# EAGLE design LED-Cube_v2 (EAGLE 9.6.2)
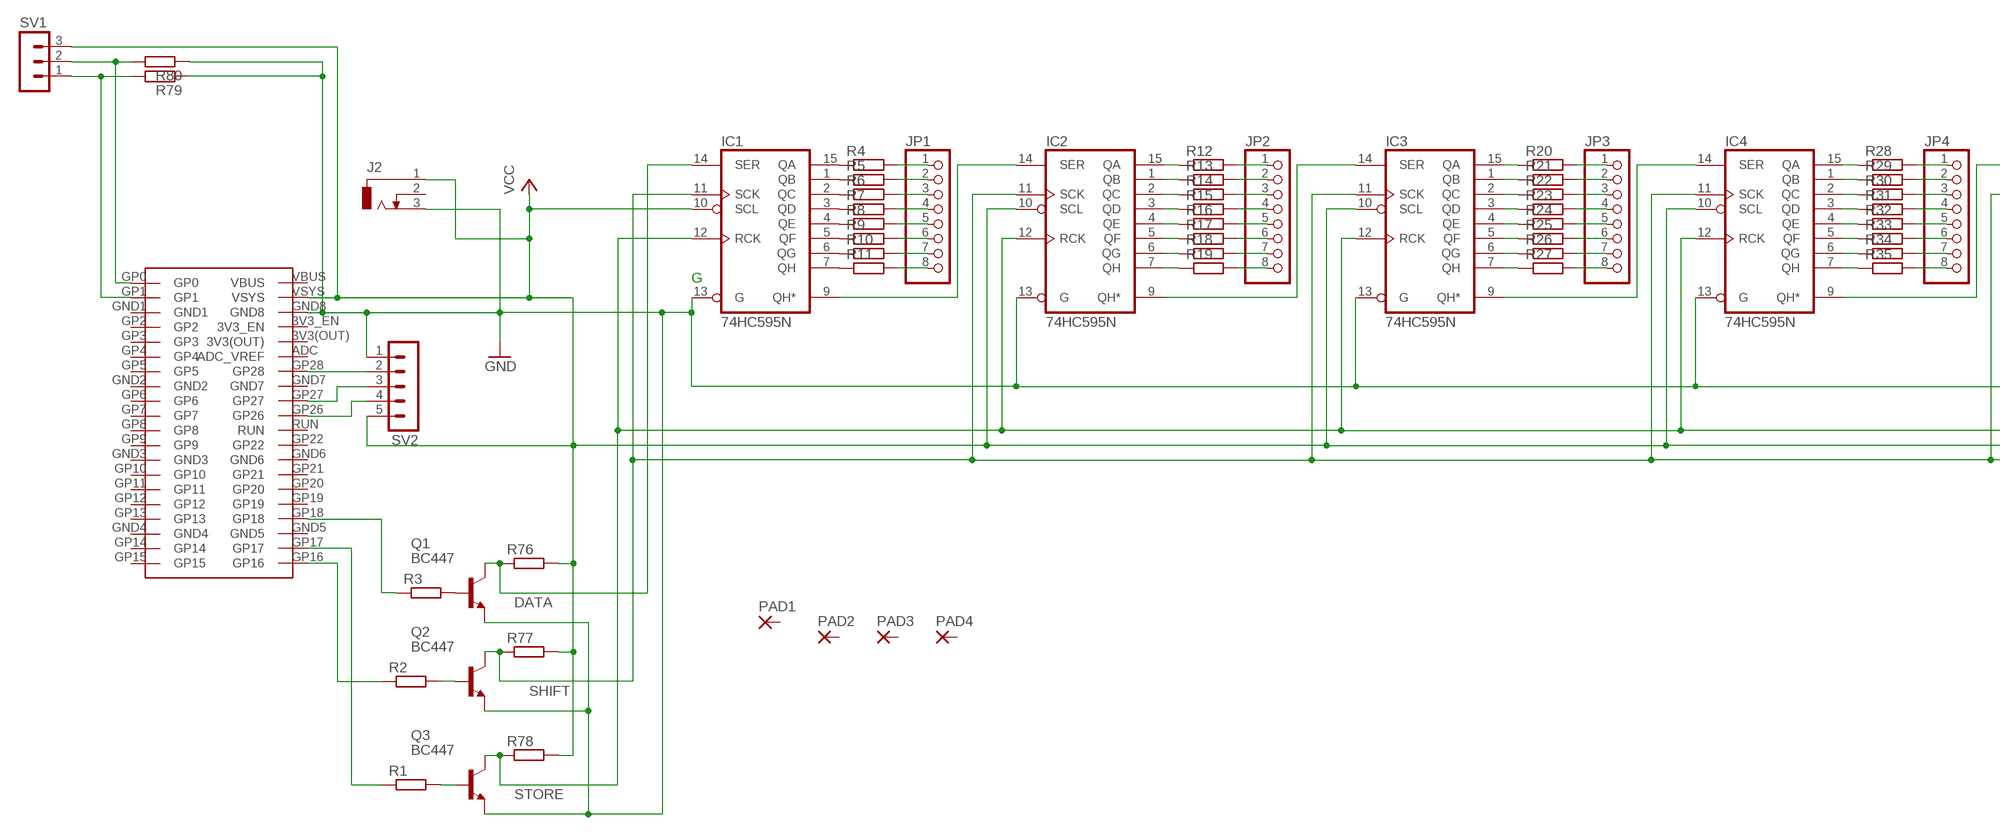
[diagram p0: schematic, sheet 1, part 1 of 2]
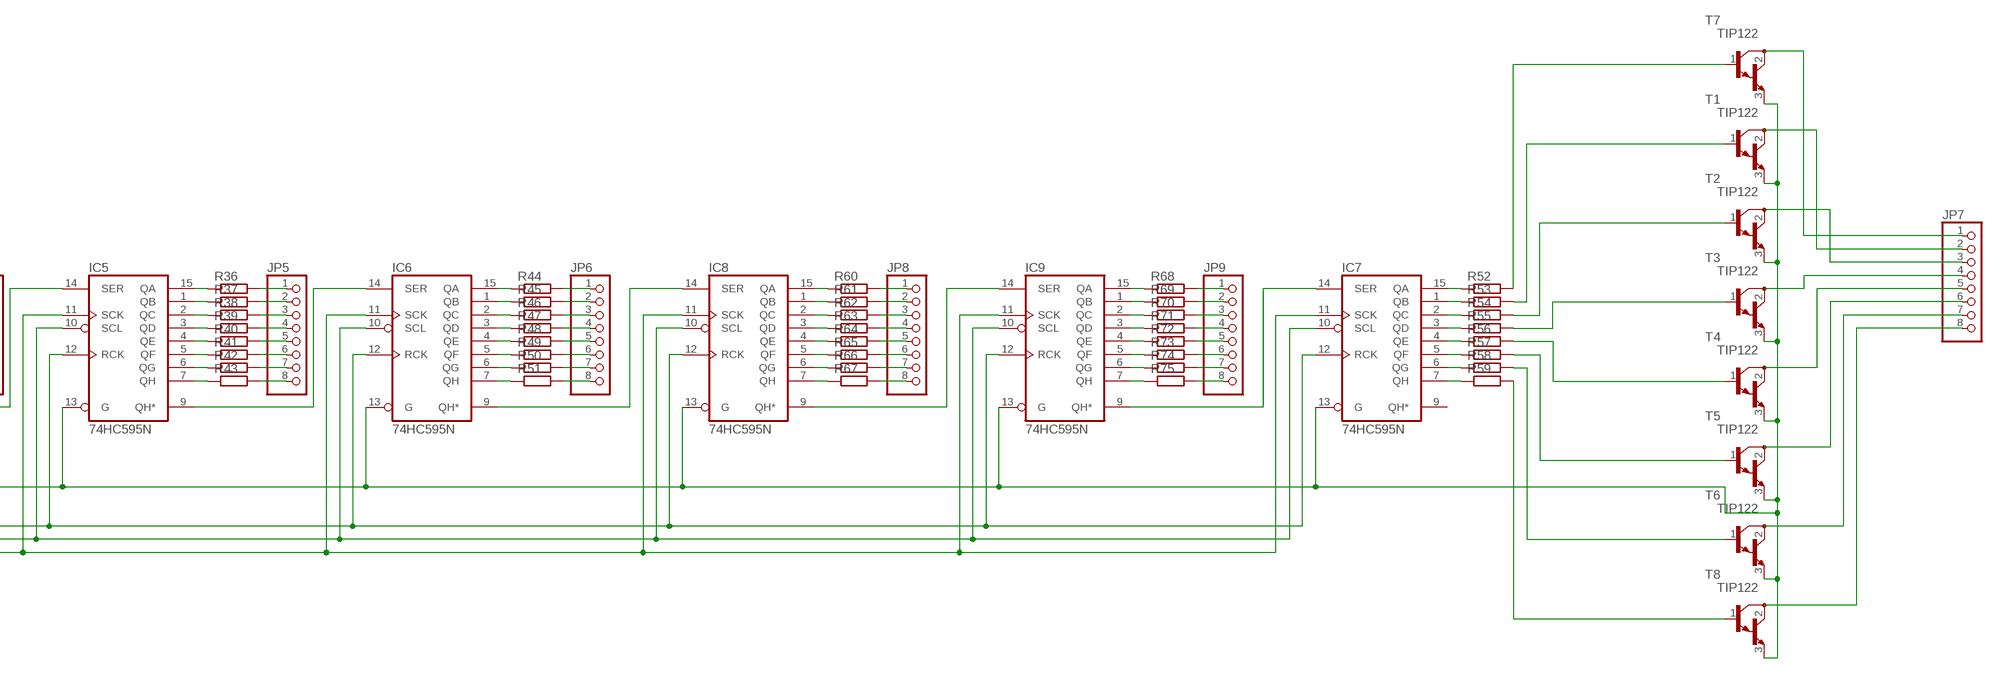
[diagram p1: schematic, sheet 1, part 2 of 2]

## Parts
IC1  74HC595N  [DIL16]
IC2  74HC595N  [DIL16]
IC3  74HC595N  [DIL16]
IC4  74HC595N  [DIL16]
IC5  74HC595N  [DIL16]
IC6  74HC595N  [DIL16]
IC7  74HC595N  [DIL16]
IC8  74HC595N  [DIL16]
IC9  74HC595N  [DIL16]
J2  DCJ0303  [DCJ0303]
JP1  PINHD-1X8  [1X08]
JP2  PINHD-1X8  [1X08]
JP3  PINHD-1X8  [1X08]
JP4  PINHD-1X8  [1X08]
JP5  PINHD-1X8  [1X08]
JP6  PINHD-1X8  [1X08]
JP7  PINHD-1X8  [1X08]
JP8  PINHD-1X8  [1X08]
JP9  PINHD-1X8  [1X08]
PAD1  3,81/1,4  [3,81/1,4]
PAD2  3,81/1,4  [3,81/1,4]
PAD3  3,81/1,4  [3,81/1,4]
PAD4  3,81/1,4  [3,81/1,4]
Q1  BC447  [TO92-EBC]
Q2  BC447  [TO92-EBC]
Q3  BC447  [TO92-EBC]
R1  R-EU_0207/10  [0207/10]
R2  R-EU_0207/10  [0207/10]
R3  R-EU_0207/10  [0207/10]
R4  R-EU_0207/10  [0207/10]
R5  R-EU_0207/10  [0207/10]
R6  R-EU_0207/10  [0207/10]
R7  R-EU_0207/10  [0207/10]
R8  R-EU_0207/10  [0207/10]
R9  R-EU_0207/10  [0207/10]
R10  R-EU_0207/10  [0207/10]
R11  R-EU_0207/10  [0207/10]
R12  R-EU_0207/10  [0207/10]
R13  R-EU_0207/10  [0207/10]
R14  R-EU_0207/10  [0207/10]
R15  R-EU_0207/10  [0207/10]
R16  R-EU_0207/10  [0207/10]
R17  R-EU_0207/10  [0207/10]
R18  R-EU_0207/10  [0207/10]
R19  R-EU_0207/10  [0207/10]
R20  R-EU_0207/10  [0207/10]
R21  R-EU_0207/10  [0207/10]
R22  R-EU_0207/10  [0207/10]
R23  R-EU_0207/10  [0207/10]
R24  R-EU_0207/10  [0207/10]
R25  R-EU_0207/10  [0207/10]
R26  R-EU_0207/10  [0207/10]
R27  R-EU_0207/10  [0207/10]
R28  R-EU_0207/10  [0207/10]
R29  R-EU_0207/10  [0207/10]
R30  R-EU_0207/10  [0207/10]
R31  R-EU_0207/10  [0207/10]
R32  R-EU_0207/10  [0207/10]
R33  R-EU_0207/10  [0207/10]
R34  R-EU_0207/10  [0207/10]
R35  R-EU_0207/10  [0207/10]
R36  R-EU_0207/10  [0207/10]
R37  R-EU_0207/10  [0207/10]
R38  R-EU_0207/10  [0207/10]
R39  R-EU_0207/10  [0207/10]
R40  R-EU_0207/10  [0207/10]
R41  R-EU_0207/10  [0207/10]
R42  R-EU_0207/10  [0207/10]
R43  R-EU_0207/10  [0207/10]
R44  R-EU_0207/10  [0207/10]
R45  R-EU_0207/10  [0207/10]
R46  R-EU_0207/10  [0207/10]
R47  R-EU_0207/10  [0207/10]
R48  R-EU_0207/10  [0207/10]
R49  R-EU_0207/10  [0207/10]
R50  R-EU_0207/10  [0207/10]
R51  R-EU_0207/10  [0207/10]
R52  R-EU_0207/10  [0207/10]
R53  R-EU_0207/10  [0207/10]
R54  R-EU_0207/10  [0207/10]
R55  R-EU_0207/10  [0207/10]
R56  R-EU_0207/10  [0207/10]
R57  R-EU_0207/10  [0207/10]
R58  R-EU_0207/10  [0207/10]
R59  R-EU_0207/10  [0207/10]
R60  R-EU_0207/10  [0207/10]
R61  R-EU_0207/10  [0207/10]
R62  R-EU_0207/10  [0207/10]
R63  R-EU_0207/10  [0207/10]
R64  R-EU_0207/10  [0207/10]
R65  R-EU_0207/10  [0207/10]
R66  R-EU_0207/10  [0207/10]
R67  R-EU_0207/10  [0207/10]
R68  R-EU_0207/10  [0207/10]
R69  R-EU_0207/10  [0207/10]
R70  R-EU_0207/10  [0207/10]
R71  R-EU_0207/10  [0207/10]
R72  R-EU_0207/10  [0207/10]
R73  R-EU_0207/10  [0207/10]
R74  R-EU_0207/10  [0207/10]
R75  R-EU_0207/10  [0207/10]
R76  R-EU_0207/10  [0207/10]
R77  R-EU_0207/10  [0207/10]
R78  R-EU_0207/10  [0207/10]
R79  R-EU_0207/10  [0207/10]
R80  R-EU_0207/10  [0207/10]
SV1  MA03-1  [MA03-1]
SV2  MA05-1  [MA05-1]
T1  TIP122  [TO220]
T2  TIP122  [TO220]
T3  TIP122  [TO220]
T4  TIP122  [TO220]
T5  TIP122  [TO220]
T6  TIP122  [TO220]
T7  TIP122  [TO220]
T8  TIP122  [TO220]
U$2  PI_PICO  [PI_PICO]

## Nets
DATA: IC1.14(SER) Q1.C R76.1
GND: IC1.13(G) IC2.13(G) IC3.13(G) IC4.13(G) IC5.13(G) IC6.13(G) IC7.13(G) IC8.13(G) IC9.13(G) J2.3 Q1.E Q2.E Q3.E R79.1 R80.1 SV2.1 T1.3(E) T2.3(E) T3.3(E) T4.3(E) T5.3(E) T6.3(E) T7.3(E) T8.3(E) U$2.GND8
N$1: R1.1 U$2.GP17
N$2: Q3.B R1.2
N$3: SV2.4 U$2.GP26
N$4: Q2.B R2.2
N$5: Q1.B R3.2
N$6: R3.1 U$2.GP18
N$7: R2.1 U$2.GP16
N$8: IC1.15(QA) R4.1
N$9: IC1.5(QF) R9.1
N$10: IC1.6(QG) R10.1
N$11: IC1.7(QH) R11.1
N$12: JP1.1 R4.2
N$13: JP1.2 R5.2
N$14: IC1.1(QB) R5.1
N$15: IC1.2(QC) R6.1
N$16: IC1.3(QD) R7.1
N$17: IC1.4(QE) R8.1
N$18: JP1.3 R6.2
N$19: JP1.4 R7.2
N$20: JP1.5 R8.2
N$21: JP1.6 R9.2
N$22: JP1.7 R10.2
N$23: JP1.8 R11.2
N$24: IC2.1(QB) R13.1
N$25: IC2.2(QC) R14.1
N$26: IC2.3(QD) R15.1
N$27: IC2.4(QE) R16.1
N$28: IC1.9(QH*) IC2.14(SER)
N$29: IC2.15(QA) R12.1
N$30: IC2.5(QF) R17.1
N$31: IC2.6(QG) R18.1
N$32: IC2.7(QH) R19.1
N$33: JP2.1 R12.2
N$34: JP2.2 R13.2
N$35: JP2.3 R14.2
N$36: JP2.4 R15.2
N$37: JP2.5 R16.2
N$38: JP2.6 R17.2
N$39: JP2.7 R18.2
N$40: JP2.8 R19.2
N$41: R80.2 SV1.2 U$2.GP0
N$42: IC2.9(QH*) IC3.14(SER)
N$43: R79.2 SV1.1 U$2.GP1
N$44: IC3.1(QB) R21.1
N$45: IC3.2(QC) R22.1
N$46: IC3.3(QD) R23.1
N$47: IC3.4(QE) R24.1
N$48: IC3.15(QA) R20.1
N$49: IC3.5(QF) R25.1
N$50: IC3.6(QG) R26.1
N$51: IC3.7(QH) R27.1
N$52: JP3.1 R20.2
N$53: JP3.2 R21.2
N$54: JP3.3 R22.2
N$55: JP3.4 R23.2
N$56: JP3.5 R24.2
N$57: JP3.6 R25.2
N$58: JP3.7 R26.2
N$59: JP3.8 R27.2
N$60: IC7.15(QA) R52.1
N$61: IC3.9(QH*) IC4.14(SER)
N$62: IC7.1(QB) R53.1
N$63: IC4.1(QB) R29.1
N$64: IC4.2(QC) R30.1
N$65: IC4.3(QD) R31.1
N$66: IC4.4(QE) R32.1
N$67: IC4.15(QA) R28.1
N$68: IC4.5(QF) R33.1
N$69: IC4.6(QG) R34.1
N$70: IC4.7(QH) R35.1
N$71: JP4.1 R28.2
N$72: JP4.2 R29.2
N$73: JP4.3 R30.2
N$74: JP4.4 R31.2
N$75: JP4.5 R32.2
N$76: JP4.6 R33.2
N$77: JP4.7 R34.2
N$78: JP4.8 R35.2
N$79: IC7.2(QC) R54.1
N$80: IC4.9(QH*) IC5.14(SER)
N$81: IC7.3(QD) R55.1
N$82: IC5.1(QB) R37.1
N$83: IC5.2(QC) R38.1
N$84: IC5.3(QD) R39.1
N$85: IC5.4(QE) R40.1
N$86: IC5.15(QA) R36.1
N$87: IC5.5(QF) R41.1
N$88: IC5.6(QG) R42.1
N$89: IC5.7(QH) R43.1
N$90: JP5.1 R36.2
N$91: JP5.2 R37.2
N$92: JP5.3 R38.2
N$93: JP5.4 R39.2
N$94: JP5.5 R40.2
N$95: JP5.6 R41.2
N$96: JP5.7 R42.2
N$97: JP5.8 R43.2
N$98: IC7.4(QE) R56.1
N$99: IC5.9(QH*) IC6.14(SER)
N$100: IC7.5(QF) R57.1
N$101: IC6.1(QB) R45.1
N$102: IC6.2(QC) R46.1
N$103: IC6.3(QD) R47.1
N$104: IC6.4(QE) R48.1
N$105: IC6.15(QA) R44.1
N$106: IC6.5(QF) R49.1
N$107: IC6.6(QG) R50.1
N$108: IC6.7(QH) R51.1
N$109: JP6.1 R44.2
N$110: JP6.2 R45.2
N$111: JP6.3 R46.2
N$112: JP6.4 R47.2
N$113: JP6.5 R48.2
N$114: JP6.6 R49.2
N$115: JP6.7 R50.2
N$116: JP6.8 R51.2
N$117: IC7.6(QG) R58.1
N$118: SV2.3 U$2.GP27
N$119: IC7.7(QH) R59.1
N$120: R52.2 T7.1(B)
N$121: R53.2 T1.1(B)
N$122: R54.2 T2.1(B)
N$123: R55.2 T3.1(B)
N$124: R56.2 T4.1(B)
N$125: R57.2 T5.1(B)
N$126: R58.2 T6.1(B)
N$127: R59.2 T8.1(B)
N$128: JP7.1 T7.2(C)
N$129: JP7.2 T1.2(C)
N$130: JP7.3 T2.2(C)
N$131: JP7.4 T3.2(C)
N$132: JP7.5 T4.2(C)
N$133: JP7.6 T5.2(C)
N$134: JP7.7 T6.2(C)
N$135: JP7.8 T8.2(C)
N$136: IC6.9(QH*) IC8.14(SER)
N$137: IC8.1(QB) R61.1
N$138: IC8.2(QC) R62.1
N$139: IC8.3(QD) R63.1
N$140: IC8.4(QE) R64.1
N$141: IC8.15(QA) R60.1
N$142: IC8.5(QF) R65.1
N$143: IC8.6(QG) R66.1
N$144: IC8.7(QH) R67.1
N$145: JP8.1 R60.2
N$146: JP8.2 R61.2
N$147: JP8.3 R62.2
N$148: JP8.4 R63.2
N$149: JP8.5 R64.2
N$150: JP8.6 R65.2
N$151: JP8.7 R66.2
N$152: JP8.8 R67.2
N$153: SV2.2 U$2.GP28
N$154: IC8.9(QH*) IC9.14(SER)
N$155: IC9.1(QB) R69.1
N$156: IC9.2(QC) R70.1
N$157: IC9.3(QD) R71.1
N$158: IC9.4(QE) R72.1
N$159: IC9.15(QA) R68.1
N$160: IC9.5(QF) R73.1
N$161: IC9.6(QG) R74.1
N$162: IC9.7(QH) R75.1
N$163: JP9.1 R68.2
N$164: JP9.2 R69.2
N$165: JP9.3 R70.2
N$166: JP9.4 R71.2
N$167: JP9.5 R72.2
N$168: JP9.6 R73.2
N$169: JP9.7 R74.2
N$170: JP9.8 R75.2
N$173: IC7.14(SER) IC9.9(QH*)
SHIFT: IC1.11(SCK) IC2.11(SCK) IC3.11(SCK) IC4.11(SCK) IC5.11(SCK) IC6.11(SCK) IC7.11(SCK) IC8.11(SCK) IC9.11(SCK) Q2.C R77.1
STORE: IC1.12(RCK) IC2.12(RCK) IC3.12(RCK) IC4.12(RCK) IC5.12(RCK) IC6.12(RCK) IC7.12(RCK) IC8.12(RCK) IC9.12(RCK) Q3.C R78.1
VCC: IC1.10(SCL) IC2.10(SCL) IC3.10(SCL) IC4.10(SCL) IC5.10(SCL) IC6.10(SCL) IC7.10(SCL) IC8.10(SCL) IC9.10(SCL) J2.1 R76.2 R77.2 R78.2 SV1.3 SV2.5 U$2.VSYS
Unconnected: IC7.9(QH*) J2.2 PAD1.1(P) PAD2.1(P) PAD3.1(P) PAD4.1(P) U$2.3V3(OUT) U$2.3V3_EN U$2.ADC(ADC_VREF) U$2.GND1 U$2.GND2 U$2.GND3 U$2.GND4 U$2.GND5 U$2.GND6 U$2.GND7 U$2.GP2 U$2.GP3 U$2.GP4 U$2.GP5 U$2.GP6 U$2.GP7 U$2.GP8 U$2.GP9 U$2.GP10 U$2.GP11 U$2.GP12 U$2.GP13 U$2.GP14 U$2.GP15 U$2.GP19 U$2.GP20 U$2.GP21 U$2.GP22 U$2.RUN U$2.VBUS

## Notes on the sheet
- G

## Power pins joined to a net without a drawn wire
GND: IC1.8(GND) IC2.8(GND) IC3.8(GND) IC4.8(GND) IC5.8(GND) IC6.8(GND) IC7.8(GND) IC8.8(GND) IC9.8(GND)
VCC: IC1.16(VCC) IC2.16(VCC) IC3.16(VCC) IC4.16(VCC) IC5.16(VCC) IC6.16(VCC) IC7.16(VCC) IC8.16(VCC) IC9.16(VCC)

## Library data of the parts
IC1-IC9 = 74xx-eu:74*595: 8-bit SHIFT REGISTER, output latch
J2 = 5mm_more_width:DCJ0303: DC POWER JACK Source: DCJ0303.pdf; OC_FARNELL: unknown; OC_NEWARK: unknown
JP1-JP9 = pinhead:PINHD-1X8: PIN HEADER
PAD1-PAD4 = wirepad:3,81/1,4: THROUGH-HOLE PAD
Q1-Q3 = transistor-npn:BC447*: NPN Transistor
R1-R80 = rcl:R-EU_: RESISTOR, European symbol; SPICEPREFIX: R
SV1 = con-lstb:MA03-1: PIN HEADER; OC_FARNELL: unknown; OC_NEWARK: unknown
SV2 = con-lstb:MA05-1: PIN HEADER; OC_FARNELL: unknown; OC_NEWARK: unknown
T1-T8 = transistor:TIP122: NPN BIPOLAR DARLINGTON TRANSISTOR
U$2 = PI_PICO:PI_PICO

## Board
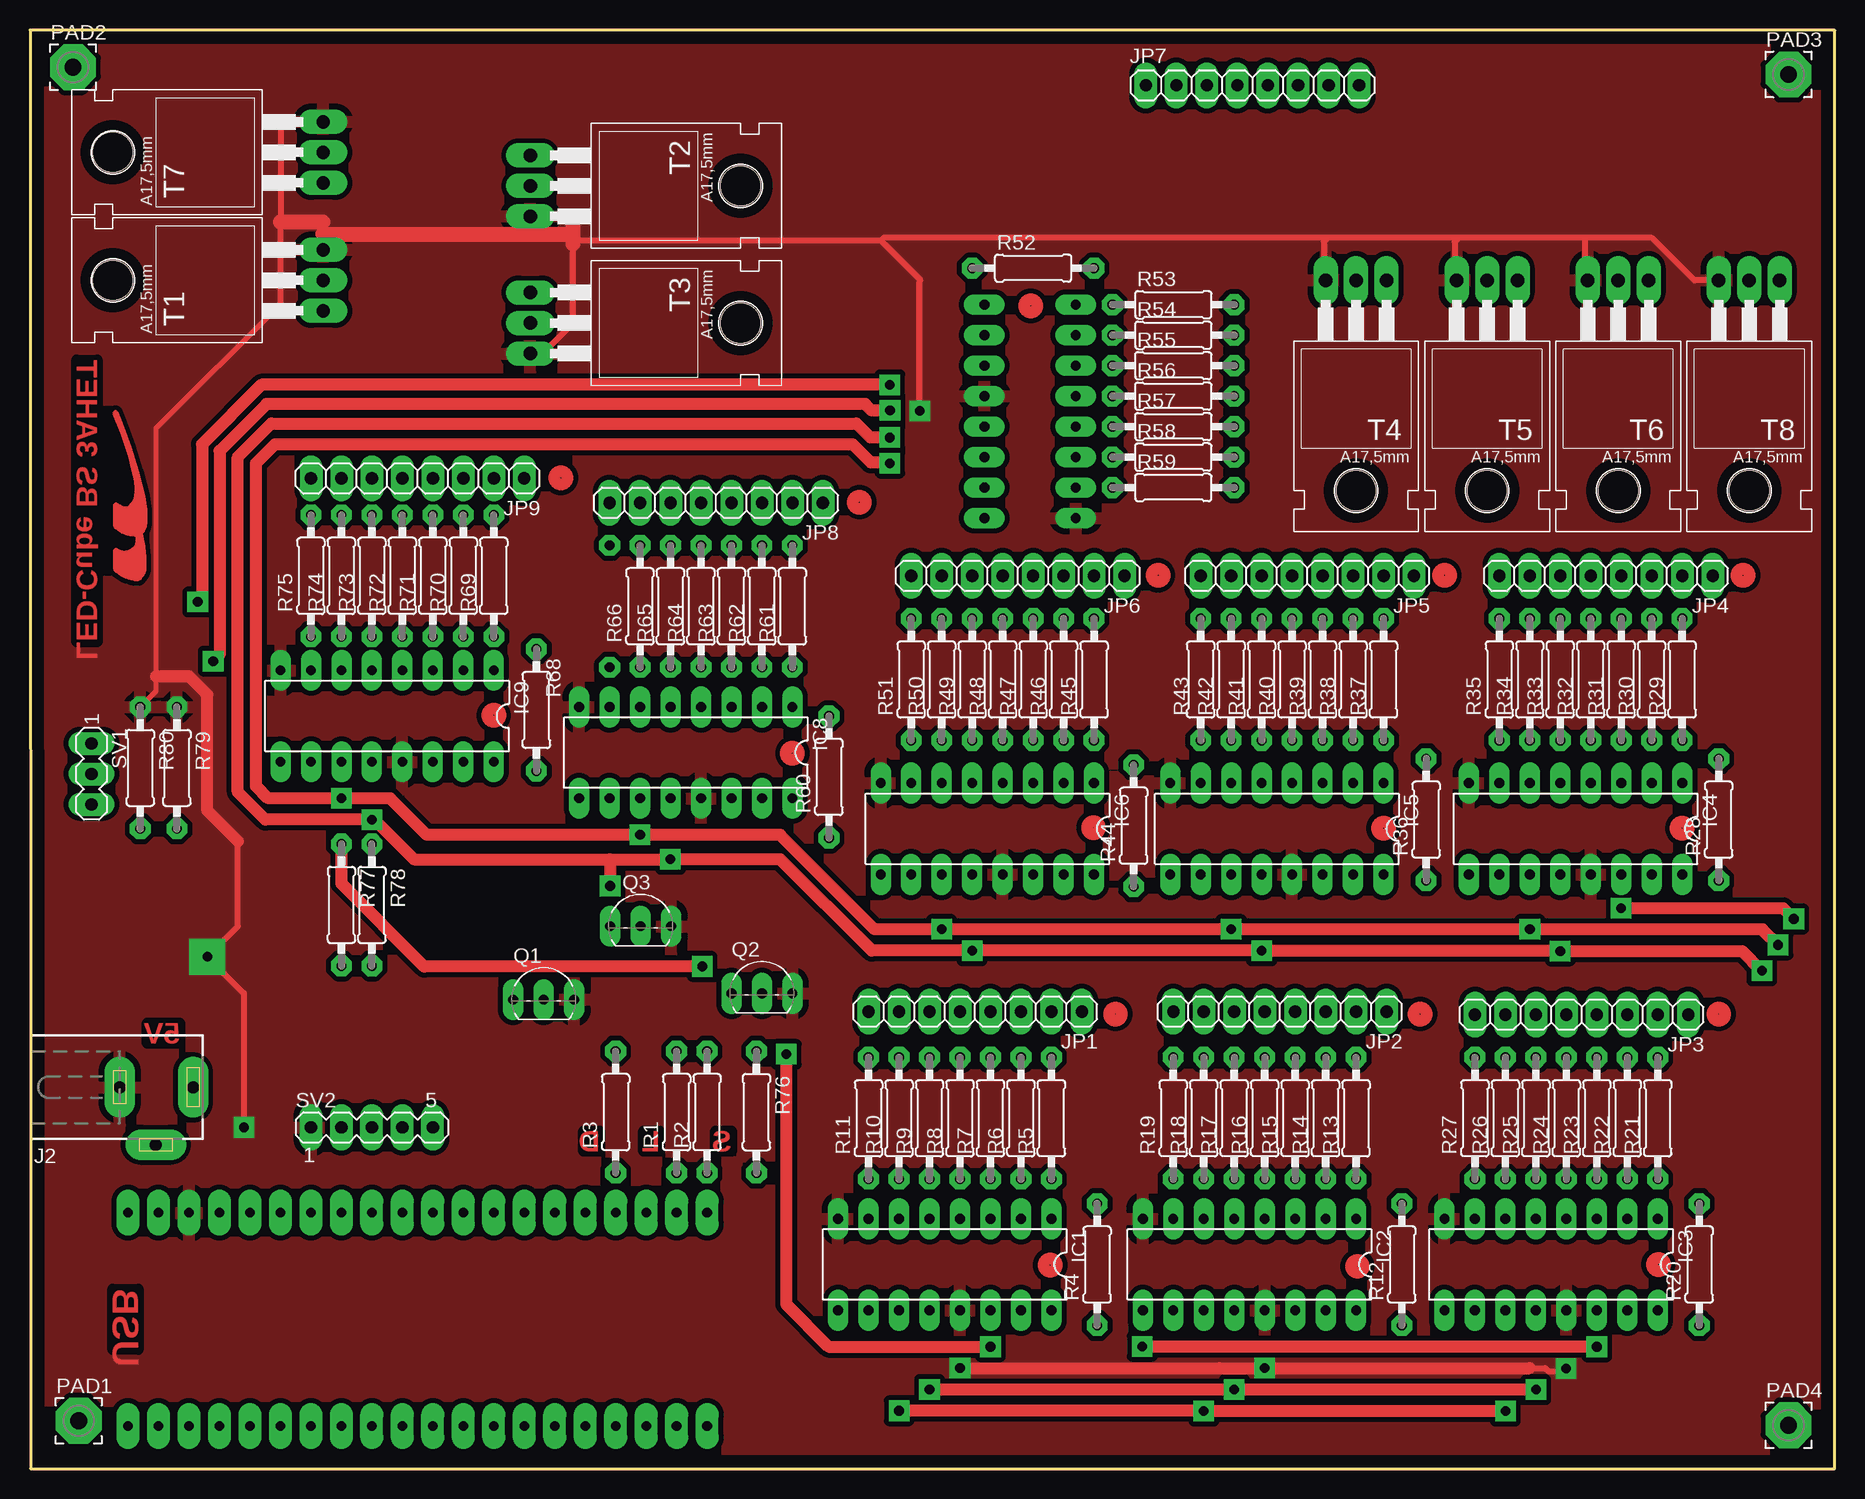
[diagram p2: board, top side]
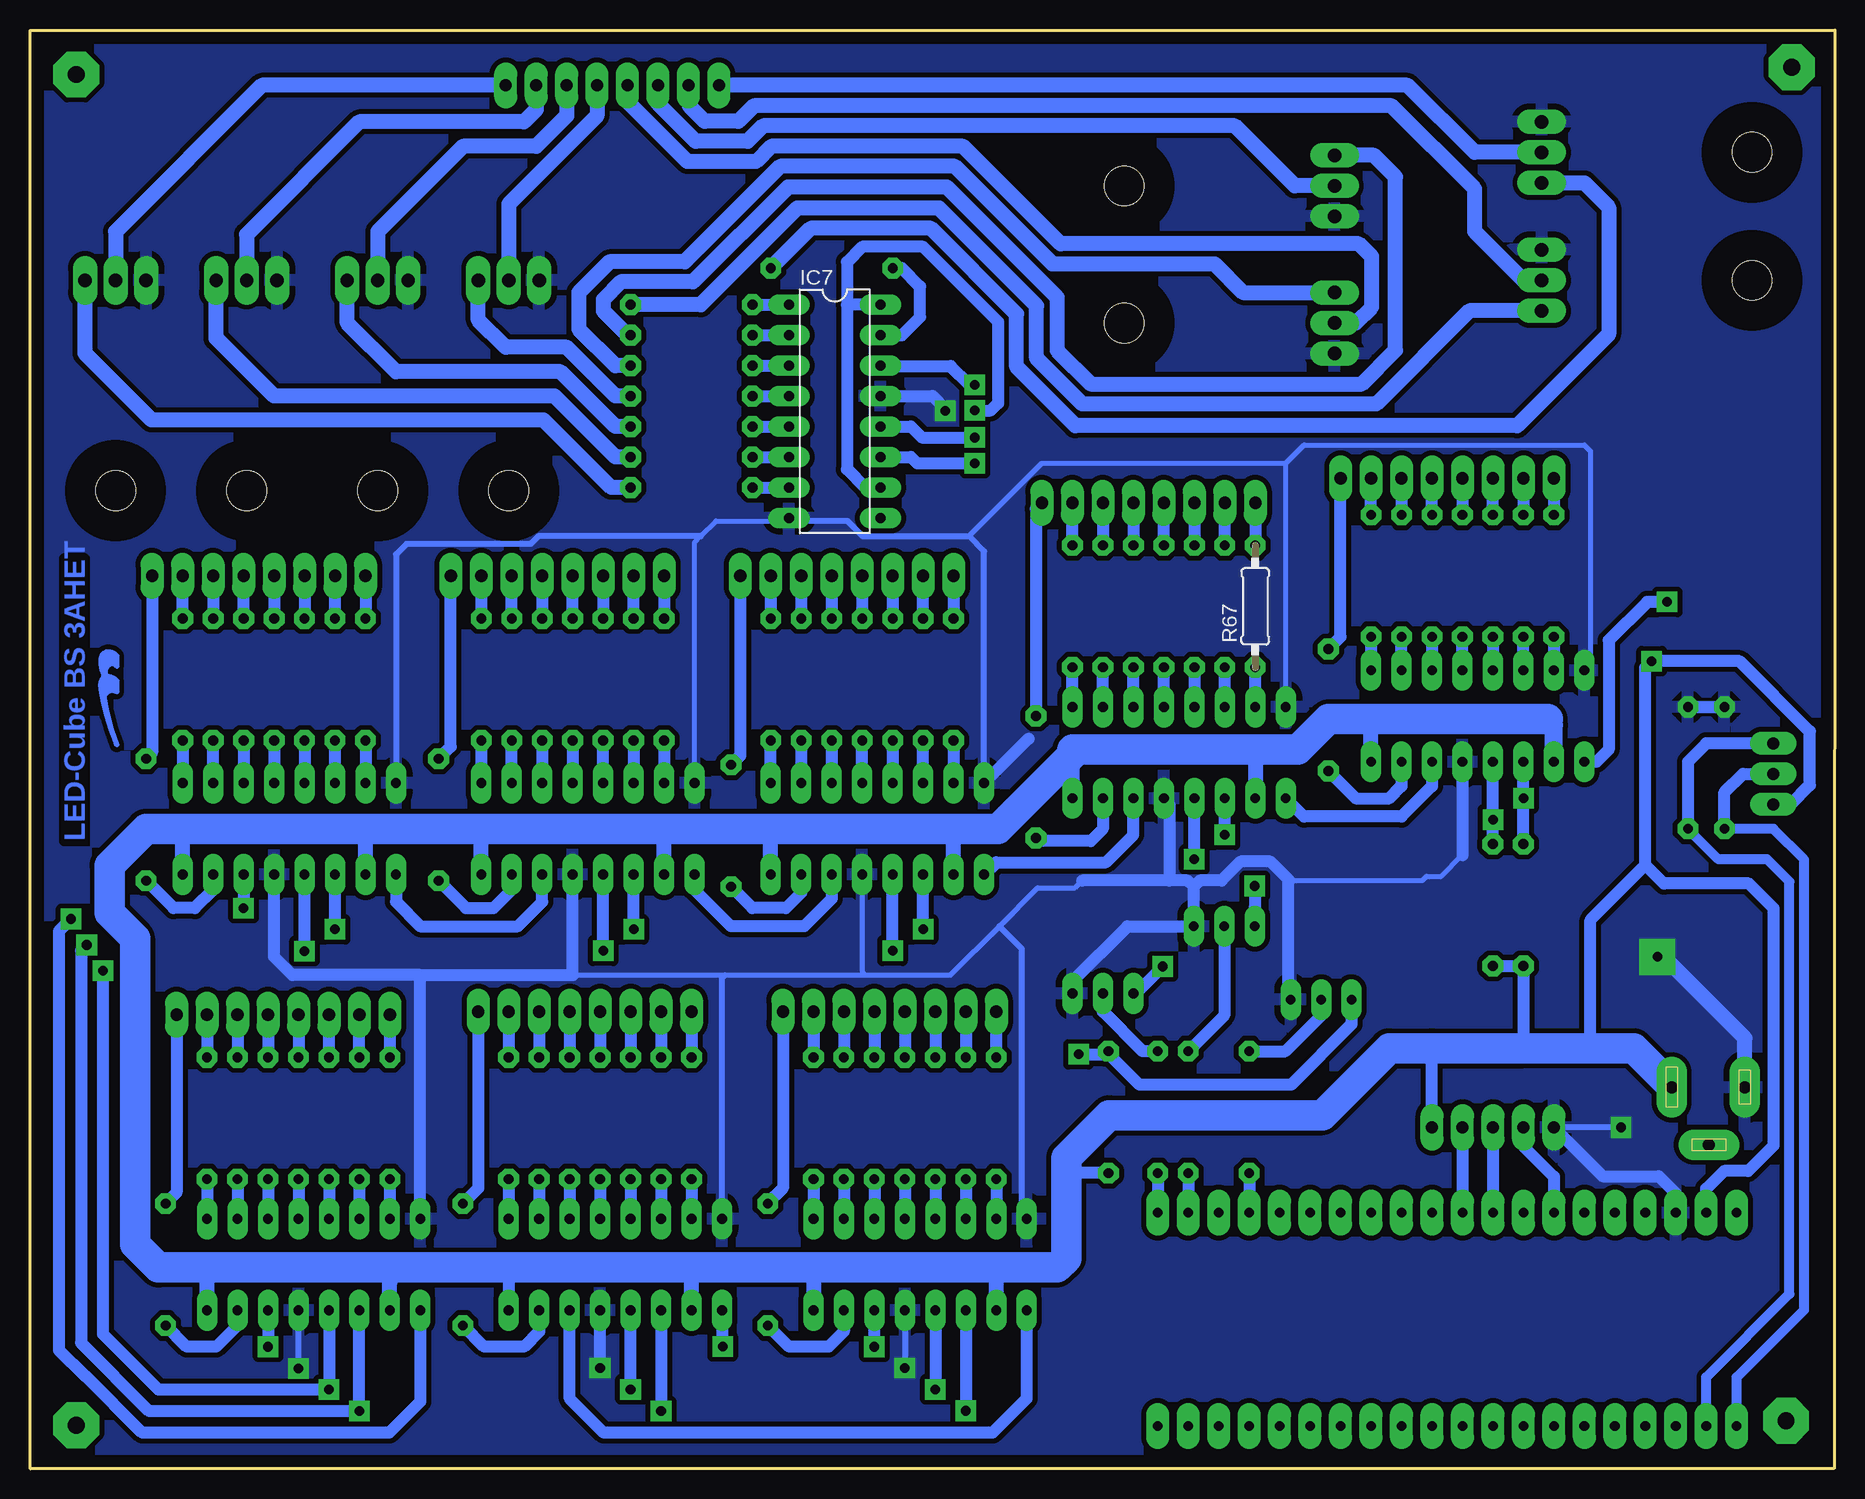
[diagram p3: board, bottom side, seen from below]

Size 150.44 x 119.95 mm. Coordinates in mm from the lower left corner, seen from the top.
Outline: 0.05,0.03 150.42,0 150.44,119.93 0,119.95 0.05,0.03
Copper layers (1*16): Top 0.035mm / dielectric 1.5mm / Bottom 0.035mm
Design rules "default *": minimum track width 16mil, minimum drill 24mil, track to track 16mil, track to pad 16mil, pad to pad 16mil, via to via 16mil, smd to smd 12mil, copper to edge 40mil, drill to drill 6mil, minimum pad ring 18mil, minimum via ring 18mil, stop-mask expansion 4mil, vias tented up to drill 0mil, thermal gap 20mil

### Footprints (pad centres in the part's own frame; a part is rotated, then mirrored left to right if it is on the bottom)
DIL16 = drill 0.813 long: 1 -8.89,-3.81; 2 -6.35,-3.81; 3 -3.81,-3.81; 4 -1.27,-3.81; 5 1.27,-3.81; 6 3.81,-3.81; 7 6.35,-3.81; 8 8.89,-3.81; 9 8.89,3.81; 10 6.35,3.81; 11 3.81,3.81; 12 1.27,3.81; 13 -1.27,3.81; 14 -3.81,3.81; 15 -6.35,3.81; 16 -8.89,3.81
DCJ0303 = drill 1 pad 2.54 long: 1 0,3.1; 2 4.8,0; 3 0,-3
1X08 = drill 1.016 long: 1 -8.89,0; 2 -6.35,0; 3 -3.81,0; 4 -1.27,0; 5 1.27,0; 6 3.81,0; 7 6.35,0; 8 8.89,0
3,81/1,4 = drill 1.397 pad 3.81 octagon: 1 0,0
TO92-EBC = drill 0.813 long: B 0,-1.27; C -2.54,-1.27; E 2.54,-1.27
0207/10 = drill 0.813 octagon: 1 -5.08,0; 2 5.08,0
MA03-1 = drill 1.016 long: 1 -2.54,0; 2 0,0; 3 2.54,0
MA05-1 = drill 1.016 long: 1 -5.08,0; 2 -2.54,0; 3 0,0; 4 2.54,0; 5 5.08,0
TO220 = drill 1.118 long: 1 -2.54,-6.35; 2 0,-6.35; 3 2.54,-6.35 | hole 3.302: 0,11.176
PI_PICO = drill 0.8 pad 1.93 long: 3V3(OUT) 7.62,15.24; 3V3_EN 7.62,17.78; ADC 7.62,12.7; GND1 -10.16,20.32; GND2 -10.16,7.62; GND3 -10.16,-5.08; GND4 -10.16,-17.78; GND5 7.62,-17.78; GND6 7.62,-5.08; GND7 7.62,7.62; GND8 7.62,20.32; GP0 -10.16,25.4; GP1 -10.16,22.86; GP2 -10.16,17.78; GP3 -10.16,15.24; GP4 -10.16,12.7; GP5 -10.16,10.16; GP6 -10.16,5.08; GP7 -10.16,2.54; GP8 -10.16,0; GP9 -10.16,-2.54; GP10 -10.16,-7.62; GP11 -10.16,-10.16; GP12 -10.16,-12.7; GP13 -10.16,-15.24; GP14 -10.16,-20.32; GP15 -10.16,-22.86; GP16 7.62,-22.86; GP17 7.62,-20.32; GP18 7.62,-15.24; GP19 7.62,-12.7; GP20 7.62,-10.16; GP21 7.62,-7.62; GP22 7.62,-2.54; GP26 7.62,2.54; GP27 7.62,5.08; GP28 7.62,10.16; RUN 7.62,0; VBUS 7.62,25.4; VSYS 7.62,22.86

### Placement (x,y rotation side)
IC1  76.25,17.04 180 top
IC2  101.65,17.04 180 top
IC3  126.8,17.04 180 top
IC4  128.83,53.37 180 top
IC5  103.94,53.37 180 top
IC6  79.81,53.37 180 top
IC7  83.36,88.16 270 bottom
IC8  54.66,59.72 180 top
IC9  29.77,62.76 180 top
J2  10.49,31.83 270 top
JP1  78.79,38.13 180 top
JP2  104.19,38.13 180 top
JP3  129.34,37.87 180 top
JP4  131.37,74.45 180 top
JP5  106.48,74.45 180 top
JP6  82.35,74.45 180 top
JP7  101.9,115.34 0 top
JP8  57.2,80.54 180 top
JP9  32.31,82.58 180 top
PAD1  4.06,4.01 0 top
PAD2  3.59,116.85 0 top
PAD3  146.59,116.25 0 top
PAD4  146.59,3.64 0 top
Q1  42.82,40.4 0 top
Q2  61.01,40.92 0 top
Q3  50.9,46.51 0 top
R1  53.9,29.74 90 top
R2  56.44,29.74 90 top
R3  48.82,29.74 90 top
R4  88.95,17.04 90 top
R5  85.14,29.24 90 top
R6  82.6,29.24 90 top
R7  80.06,29.24 90 top
R8  77.52,29.24 90 top
R9  74.98,29.24 90 top
R10  72.44,29.24 90 top
R11  69.9,29.24 90 top
R12  114.35,17.04 90 top
R13  110.54,29.24 90 top
R14  108,29.24 90 top
R15  105.46,29.24 90 top
R16  102.92,29.24 90 top
R17  100.38,29.24 90 top
R18  97.84,29.24 90 top
R19  95.3,29.24 90 top
R20  139.14,17.04 90 top
R21  135.69,29.24 90 top
R22  133.15,29.24 90 top
R23  130.61,29.24 90 top
R24  128.07,29.24 90 top
R25  125.53,29.24 90 top
R26  122.99,29.24 90 top
R27  120.45,29.24 90 top
R28  140.77,54.13 90 top
R29  137.72,65.81 90 top
R30  135.18,65.81 90 top
R31  132.64,65.81 90 top
R32  130.1,65.81 90 top
R33  127.56,65.81 90 top
R34  125.02,65.81 90 top
R35  122.48,65.81 90 top
R36  116.38,54.13 90 top
R37  112.83,65.81 90 top
R38  110.29,65.81 90 top
R39  107.75,65.81 90 top
R40  105.21,65.81 90 top
R41  102.67,65.81 90 top
R42  100.13,65.81 90 top
R43  97.59,65.81 90 top
R44  92,53.62 90 top
R45  88.7,65.81 90 top
R46  86.16,65.81 90 top
R47  83.62,65.81 90 top
R48  81.08,65.81 90 top
R49  78.54,65.81 90 top
R50  76,65.81 90 top
R51  73.46,65.81 90 top
R52  83.62,100.1 0 top
R53  95.3,97.05 0 top
R54  95.3,94.51 0 top
R55  95.3,91.97 0 top
R56  95.3,89.43 0 top
R57  95.3,86.89 0 top
R58  95.3,84.35 0 top
R59  95.3,81.81 0 top
R60  66.6,57.68 90 top
R61  63.55,71.91 90 top
R62  61.01,71.91 90 top
R63  58.47,71.91 90 top
R64  55.93,71.91 90 top
R65  53.39,71.91 90 top
R66  50.85,71.91 90 top
R67  48.31,71.91 90 bottom
R68  42.21,63.27 90 top
R69  38.66,74.45 90 top
R70  36.12,74.45 90 top
R71  33.58,74.45 90 top
R72  31.04,74.45 90 top
R73  28.5,74.45 90 top
R74  25.96,74.45 90 top
R75  23.42,74.45 90 top
R76  60.55,29.74 270 top
R77  25.96,47.02 270 top
R78  28.5,47.02 270 top
R79  12.24,58.45 270 top
R80  9.19,58.45 270 top
SV1  5.13,57.94 270 top
SV2  28.5,28.47 0 top
T1  18.08,99.09 90 top
T2  48.06,106.96 270 top
T3  48.06,95.53 270 top
T4  110.54,92.74 180 top
T5  121.46,92.74 180 top
T6  132.38,92.74 180 top
T7  18.08,109.75 90 top
T8  143.31,92.74 180 top
U$1  [LOGOBOT_8]  143.1,64.02 270 top
U$2  33.58,13.74 90 top
U$3  [LOGOTOP_15]  7.16,79.27 270 top

### Tracks (layer width: path | path; a pad name or v marks a point on that pad's centre or on a via)
DATA  (via drill 0.8, 0.8 pad 1.2)
  Top 1.016: v80.06,10.19 66.58,10.19 63.04,13.73 v63.04,34.57
  Bottom 1.016: v80.06,10.19 IC1.14 | Q1.C 40.28,37.06 45.31,32.03 57.96,32.03 60.55,34.62 R76.1 60.81,34.57 v63.04,34.57
GND  (via drill 0.8, 0.8 pad 1.1, 0.8 pad 1.2, 0.8 pad 3)
  Top 0.406: R80.1 10.48,64.81 10.48,66.07 10.48,86.71 20.88,97.11
  Top 0.508: v74.16,88.21 74.16,99.03 74.22,99.09 70.92,102.39 | 70.92,102.39 45.49,102.39 45.24,102.13 45.24,95.55 45.26,95.53 42.72,92.99 T3.3 | T8.3 138.73,99.09 135.18,102.64 129.59,102.64 | 129.59,102.64 129.59,99.34 T6.3 | T5.3 118.77,99.24 118.77,102.32 119.09,102.64 | 129.59,102.64 119.09,102.64 | T4.3 107.85,99.24 107.85,102.32 108.17,102.64 | 119.09,102.64 108.17,102.64 | 20.88,97.11 20.88,103.96 20.88,111.79 21.39,112.29 T7.3 | T1.3 24.43,102.95 24.43,103.96 | 45.24,104.42 T2.3 | 108.17,102.64 71.17,102.64 70.92,102.39 | 125,8.41 126.29,8.41 126.55,8.15 127.83,8.15 v128.05,8.38 | 17.32,52.35 17.32,45.24 v14.78,42.7 17.83,39.65 v17.83,28.47
  Top 1.016: 125,8.41 v102.92,8.41 v102.91,8.4 99.14,8.4 v77.52,8.4 | 17.32,52.35 14.78,54.89 14.78,64.54 13.26,66.07 10.48,66.07
  Top 1.27: 45.24,104.42 45.24,102.95 | 45.24,102.95 45.24,102.13 | 20.88,103.96 24.43,103.96 | 24.43,102.95 45.24,102.95
  Bottom 0.406: IC5.8 95.05,77.24 94.54,77.75 93.27,79.02 87.17,79.02 | IC6.13 81.08,41.43 80.82,41.17 | 105.21,41.17 92.51,41.17 80.82,41.17 | 80.82,41.17 73.71,41.17 69.65,45.24 66.45,48.44 63.34,48.44 62.73,49.05 | 45.56,49.05 45.48,49.05 44.33,49.05 34.4,49.05 34.04,49.4 32.82,49.4 31.04,51.18 | 72.19,77.75 66.09,83.85 45.77,83.85 | IC8.8 45.77,83.85 | 45.77,83.85 44.25,85.37 20.88,85.37 20.37,84.86 20.37,67.08 IC9.8
  Bottom 0.508: v128.05,8.38 128.05,13.22 IC3.13 | IC2.8 92.76,40.92 92.51,41.17 | IC1.8 67.36,20.98 67.77,21.39 67.77,43.36 69.65,45.24 | IC1.13 v77.52,8.4 | IC6.8 70.92,76.48 72.19,77.75 81.05,77.75 82.32,79.02 87.17,79.02 | 94.54,77.75 108.06,77.75 108.7,77.11 119.05,77.11 119.94,76.23 IC4.8 | v17.83,28.47 SV2.1
  Bottom 1.016: v102.92,8.41 IC2.13 | IC3.8 117.91,41.17 | 117.91,41.17 128.57,41.17 130.1,42.7 IC4.13 | IC5.13 105.21,41.17 117.91,41.17 | IC8.13 55.47,55.45 55.47,49.05 | IC6.8 67.21,60.88 | R79.1 R80.1 | v74.16,88.21 74.16,88.36 75.23,89.43 IC7.13 | 87.17,79.02 IC7.8 | IC9.13 31.04,51.18 | Q2.E 63.55,40.67 58.98,45.24 Q3.E 53.44,48.54 | SV2.1 19.35,24.41 14.68,24.41 13.26,22.98 U$2.GND8 | 45.56,49.05 45.56,39.33 Q1.E | 53.44,48.54 52.93,49.05 51.12,49.05 49.54,50.63 47.06,50.63 45.48,49.05 | 53.44,48.54 53.95,49.05 55.47,49.05 | 55.47,49.05 62.73,49.05
  Bottom 1.27: J2.3 7.49,35.91 14.27,42.7 v14.78,42.7
  pour Bottom: 0.56,118.9 149.91,118.9 149.91,0.53 0.56,0.53
  pour Top: 0.56,118.9 149.91,118.9 149.91,0.53 0.56,0.53
N$1
  Bottom 1.016: R1.1 U$2.GP17
N$2
  Bottom 1.016: Q3.B 50.9,37.82 R1.2
N$3
  Bottom 1.016: SV2.4 U$2.GP26
N$4
  Bottom 1.016: Q2.B 61.01,38.13 57.71,34.82 R2.2
N$5
  Bottom 1.016: R3.2 45.82,34.82 42.82,37.82 Q1.B
N$6
  Bottom 1.016: R3.1 U$2.GP18
N$7
  Bottom 1.016: R2.1 U$2.GP16
N$8
  Bottom 1.016: IC1.15 82.6,11.46 83.87,10.19 87.17,10.19 R4.1
N$9
  Bottom 1.016: R9.1 IC1.5
N$10
  Bottom 1.016: R10.1 IC1.6
N$11
  Bottom 1.016: R11.1 IC1.7
N$12
  Bottom 1.016: JP1.1 87.68,23.39 R4.2
N$13
  Bottom 1.016: JP1.2 R5.2
N$14
  Bottom 1.016: R5.1 IC1.1
N$15
  Bottom 1.016: R6.1 IC1.2
N$16
  Bottom 1.016: R7.1 IC1.3
N$17
  Bottom 1.016: R8.1 IC1.4
N$18
  Bottom 1.016: JP1.3 R6.2
N$19
  Bottom 1.016: JP1.4 R7.2
N$20
  Bottom 1.016: JP1.5 R8.2
N$21
  Bottom 1.016: JP1.6 R9.2
N$22
  Bottom 1.016: JP1.7 R10.2
N$23
  Bottom 1.016: R11.2 JP1.8
N$24
  Bottom 1.016: R13.1 IC2.1
N$25
  Bottom 1.016: R14.1 IC2.2
N$26
  Bottom 1.016: R15.1 IC2.3
N$27
  Bottom 1.016: R16.1 IC2.4
N$28
  Bottom 1.016: IC1.9 67.36,5.87 70.21,3.02 102.62,3.02 105.46,5.87 IC2.14
N$29
  Bottom 1.016: IC2.15 108,11.46 109.27,10.19 112.57,10.19 R12.1
N$30
  Bottom 1.016: R17.1 IC2.5
N$31
  Bottom 1.016: R18.1 IC2.6
N$32
  Bottom 1.016: R19.1 IC2.7
N$33
  Bottom 1.016: JP2.1 113.08,23.39 R12.2
N$34
  Bottom 1.016: JP2.2 R13.2
N$35
  Bottom 1.016: JP2.3 R14.2
N$36
  Bottom 1.016: JP2.4 R15.2
N$37
  Bottom 1.016: JP2.5 R16.2
N$38
  Bottom 1.016: JP2.6 R17.2
N$39
  Bottom 1.016: JP2.7 R18.2
N$40
  Bottom 1.016: JP2.8 R19.2
N$41
  Bottom 0.813: U$2.GP0 8.18,7.65 2.57,13.26 2.57,50.8 5.13,53.37 R80.2
  Bottom 1.016: R80.2 9.19,56.41 7.67,57.94 SV1.2
N$42  (via drill 0.8)
  Top 1.016: v92.71,10.21 92.73,10.19 v130.61,10.19
  Bottom 1.016: IC2.9 92.76,10.26 v92.71,10.21 | IC3.14 v130.61,10.19
N$43
  Bottom 0.813: U$2.GP1 10.72,7.65 3.78,14.58 3.78,48.97 5.64,50.83 9.7,50.83 R79.2
  Bottom 1.016: SV1.1 10.72,60.48 12.24,58.95 R79.2
N$44
  Bottom 1.016: R21.1 IC3.1
N$45
  Bottom 1.016: R22.1 IC3.2
N$46
  Bottom 1.016: R23.1 IC3.3
N$47
  Bottom 1.016: R24.1 IC3.4
N$48
  Bottom 1.016: IC3.15 133.15,11.96 134.92,10.19 137.36,10.19 R20.1
N$49
  Bottom 1.016: R25.1 IC3.5
N$50
  Bottom 1.016: R26.1 IC3.6
N$51
  Bottom 1.016: R27.1 IC3.7
N$52
  Bottom 1.016: JP3.1 138.23,23.04 R20.2
N$53
  Bottom 1.016: JP3.2 R21.2
N$54
  Bottom 1.016: JP3.3 R22.2
N$55
  Bottom 1.016: JP3.4 R23.2
N$56
  Bottom 1.016: JP3.5 R24.2
N$57
  Bottom 1.016: R25.2 JP3.6
N$58
  Bottom 1.016: R26.2 JP3.7
N$59
  Bottom 1.016: JP3.8 R27.2
N$60
  Bottom 1.016: IC7.15 77.77,94.51 76.25,96.04 76.25,98.58 77.77,100.1 R52.1
N$61  (via drill 0.8)
  Top 1.016: v147.02,45.85 146.1,46.76 v132.64,46.76
  Bottom 1.016: IC3.9 117.91,5.61 120.5,3.02 141.08,3.02 145.86,7.8 145.86,7.76 148.03,9.93 148.03,44.83 v147.02,45.85 | IC4.14 v132.64,46.76
N$62
  Bottom 1.016: R53.1 IC7.1
N$63
  Bottom 1.016: R29.1 IC4.1
N$64
  Bottom 1.016: IC4.2 R30.1
N$65
  Bottom 1.016: R31.1 IC4.3
N$66
  Bottom 1.016: R32.1 IC4.4
N$67
  Bottom 1.016: IC4.15 135.18,48.29 136.7,46.76 138.48,46.76 R28.1
N$68
  Bottom 1.016: R33.1 IC4.5
N$69
  Bottom 1.016: IC4.6 R34.1
N$70
  Bottom 1.016: R35.1 IC4.7
N$71
  Bottom 1.016: JP4.1 140.26,59.72 R28.2
N$72
  Bottom 1.016: R29.2 JP4.2
N$73
  Bottom 1.016: JP4.3 R30.2
N$74
  Bottom 1.016: R31.2 JP4.4
N$75
  Bottom 1.016: JP4.5 R32.2
N$76
  Bottom 1.016: JP4.6 R33.2
N$77
  Bottom 1.016: R34.2 JP4.7
N$78
  Bottom 1.016: JP4.8 R35.2
N$79
  Bottom 1.016: R54.1 IC7.2
N$80
  Bottom 1.016: IC4.9 119.94,47.27 117.91,45.24 109.78,45.24 107.75,47.27 IC5.14
N$81
  Bottom 1.016: R55.1 IC7.3
N$82
  Bottom 1.016: R37.1 IC5.1
N$83
  Bottom 1.016: IC5.2 R38.1
N$84
  Bottom 1.016: R39.1 IC5.3
N$85
  Bottom 1.016: R40.1 IC5.4
N$86
  Bottom 1.016: R36.1 114.1,46.76 111.81,46.76 110.29,48.29 IC5.15
N$87
  Bottom 1.016: IC5.5 R41.1
N$88
  Bottom 1.016: R42.1 IC5.6
N$89
  Bottom 1.016: R43.1 IC5.7
N$90
  Bottom 1.016: R36.2 115.37,60.22 JP5.1
N$91
  Bottom 1.016: JP5.2 R37.2
N$92
  Bottom 1.016: R38.2 JP5.3
N$93
  Bottom 1.016: JP5.4 R39.2
N$94
  Bottom 1.016: R40.2 JP5.5
N$95
  Bottom 1.016: JP5.6 R41.2
N$96
  Bottom 1.016: R42.2 JP5.7
N$97
  Bottom 1.016: JP5.8 R43.2
N$98
  Bottom 1.016: R56.1 IC7.4
N$99
  Bottom 1.016: IC6.14 83.62,47.52 85.9,45.24 92,45.24 95.05,48.29 IC5.9
N$100
  Bottom 1.016: R57.1 IC7.5
N$101
  Bottom 1.016: IC6.1 R45.1
N$102
  Bottom 1.016: R46.1 IC6.2
N$103
  Bottom 1.016: R47.1 IC6.3
N$104
  Bottom 1.016: IC6.4 R48.1
N$105
  Bottom 1.016: R44.1 90.22,46.76 87.43,46.76 86.16,48.03 IC6.15
N$106
  Bottom 1.016: R49.1 IC6.5
N$107
  Bottom 1.016: IC6.6 R50.1
N$108
  Bottom 1.016: R51.1 IC6.7
N$109
  Bottom 1.016: JP6.1 91.24,59.46 R44.2
N$110
  Bottom 1.016: JP6.2 R45.2
N$111
  Bottom 1.016: JP6.3 R46.2
N$112
  Bottom 1.016: JP6.4 R47.2
N$113
  Bottom 1.016: JP6.5 R48.2
N$114
  Bottom 1.016: JP6.6 R49.2
N$115
  Bottom 1.016: R50.2 JP6.7
N$116
  Bottom 1.016: JP6.8 R51.2
N$117
  Bottom 1.016: R58.1 IC7.6
N$118
  Bottom 1.016: SV2.3 U$2.GP27
N$119
  Bottom 1.016: R59.1 IC7.7
N$120
  Bottom 1.27: T7.1 20.88,107.21 18.85,105.18 18.85,94.59 26.47,86.97 63.3,86.97 68.2,91.87 68.2,96.28 75.35,103.43 85.38,103.43 R52.2
N$121
  Bottom 1.27: T1.1 30.45,96.55 38.23,88.77 62.72,88.77 66.53,92.58 66.53,96.97 74.66,105.11 86.49,105.11 94.54,97.05 R53.2
N$122
  Bottom 1.27: R54.2 100.63,94.51 102.67,96.55 102.67,97.49 101.2,98.96 95.17,98.96 87.27,106.86 74.02,106.86 64.82,97.66 64.82,93.24 62.03,90.45 39.43,90.45 36.63,93.25 36.63,107.72 38.4,109.5 T2.1
N$123
  Bottom 1.27: R55.2 101.65,91.97 104.7,95.02 104.7,98.07 102.13,100.63 95.87,100.63 87.92,108.59 73.35,108.59 65.23,100.46 51.71,100.46 49.33,98.07 T3.1
N$124
  Bottom 1.27: R56.2 101.65,89.43 105.71,93.5 110.79,93.5 113.08,95.78 T4.1
N$125
  Bottom 1.27: R57.2 101.65,86.89 106.22,91.47 119.94,91.47 124,95.53 T5.1
N$126
  Bottom 1.27: R58.2 101.65,84.35 106.73,89.43 130.1,89.43 134.92,94.26 T6.1
N$127
  Bottom 1.27: R59.2 102.01,81.81 107.64,87.45 140.31,87.45 145.85,92.99 T8.1
N$128
  Bottom 1.27: T7.2 30.02,109.75 35.61,115.34 JP7.1
N$129
  Bottom 1.27: JP7.2 95.48,115.27 95.48,113.62 94.21,112.34 91.39,112.34 90.09,113.64 36.96,113.64 30.02,106.71 30.02,103.15 25.96,99.09 T1.2
N$130
  Bottom 1.27: JP7.3 98.09,113.82 94.94,110.67 90.63,110.67 89.33,111.96 50.01,111.96 45.01,106.96 T2.2
N$131
  Bottom 1.27: T3.2 41.68,95.55 39.91,95.55 38.61,96.86 38.61,101.07 39.67,102.13 64.53,102.13 72.66,110.26 88.66,110.26 89.93,108.99 95.64,108.99 100.63,113.99 JP7.4
N$132
  Bottom 1.27: JP7.5 103.17,112.8 110.54,105.44 T4.2
N$133
  Bottom 1.27: JP7.6 105.71,112.8 108.25,110.26 114.35,110.26 121.46,103.15 T5.2
N$134
  Bottom 1.27: JP7.7 108.25,113.31 109.27,112.29 122.99,112.29 132.38,102.9 T6.2
N$135
  Bottom 1.27: JP7.8 131.11,115.34 143.31,103.15 T8.2
N$136
  Bottom 1.016: IC6.9 69.9,50.57 60.76,50.57 58.47,52.86 IC8.14
N$137
  Bottom 1.016: IC8.1 R61.1
N$138
  Bottom 1.016: IC8.2 R62.1
N$139
  Bottom 1.016: IC8.3 R63.1
N$140
  Bottom 1.016: IC8.4 R64.1
N$141
  Bottom 1.016: IC8.15 61.01,53.37 62.03,52.35 66.34,52.35 R60.1
N$142
  Bottom 1.016: R65.1 IC8.5
N$143
  Bottom 1.016: IC8.6 R66.1
N$144
  Bottom 1.016: IC8.7 R67.1
N$145
  Bottom 1.016: JP8.1 66.6,80.04 R60.2
N$146
  Bottom 1.016: R61.2 JP8.2
N$147
  Bottom 1.016: JP8.3 R62.2
N$148
  Bottom 1.016: JP8.4 R63.2
N$149
  Bottom 1.016: R64.2 JP8.5
N$150
  Bottom 1.016: JP8.6 R65.2
N$151
  Bottom 1.016: R66.2 JP8.7
N$152
  Bottom 1.016: JP8.8 R67.2
N$153
  Bottom 1.016: SV2.2 25.96,26.9 23.42,24.36 U$2.GP28
N$154
  Bottom 1.016: IC9.14 33.58,56.92 36.12,54.38 44.25,54.38 IC8.9
N$155
  Bottom 1.016: R69.1 IC9.1
N$156
  Bottom 1.016: IC9.2 R70.1
N$157
  Bottom 1.016: R71.1 IC9.3
N$158
  Bottom 1.016: IC9.4 R72.1
N$159
  Bottom 1.016: IC9.15 36.12,56.92 37.13,55.91 39.93,55.91 R68.1
N$160
  Bottom 1.016: R73.1 IC9.5
N$161
  Bottom 1.016: IC9.6 R74.1
N$162
  Bottom 1.016: R75.1 IC9.7
N$163
  Bottom 1.016: R68.2 41.2,69.37 JP9.1
N$164
  Bottom 1.016: R69.2 JP9.2
N$165
  Bottom 1.016: JP9.3 R70.2
N$166
  Bottom 1.016: R71.2 JP9.4
N$167
  Bottom 1.016: JP9.5 R72.2
N$168
  Bottom 1.016: R73.2 JP9.6
N$169
  Bottom 1.016: JP9.7 R74.2
N$170
  Bottom 1.016: JP9.8 R75.2
N$173  (via drill 0.8)
  Top 1.016: v71.68,90.37 19.28,90.37 14.34,85.43 14.34,72.28 v13.98,72.28
  Bottom 1.016: IC7.14 79.53,91.95 73.71,91.95 72.14,90.37 v71.68,90.37 | IC9.9 19.86,58.95 18.85,59.97 18.85,69.08 15.65,72.28 v13.98,72.28
SHIFT  (via drill 0.8, 0.8 pad 1.2)
  Top 1.016: v72.44,4.85 72.49,4.85 72.5,4.86 97.81,4.86 v97.84,4.82 v122.98,4.82 v122.99,4.83 | v145.71,43.68 144.41,44.99 v125.02,44.99 v125.02,44.98 v100.13,44.98 v76,44.98 70.41,44.98 62.53,52.86 v50.85,52.86 33.07,52.86 30.02,55.91 v25.96,55.91 19.86,55.91 18.85,56.92 18.85,83.85 20.42,85.42 68.58,85.42 70.1,83.9 71.63,83.9 v71.68,83.85 | v56.03,41.89 32.86,41.89 25.96,48.79 R77.1
  Bottom 1.016: IC1.11 v72.44,4.85 | IC2.11 v97.84,4.82 | IC3.11 v122.99,4.83 140.49,4.83 146.19,10.53 146.19,43.2 v145.71,43.68 | v125.02,44.98 IC4.11 | v100.13,44.98 IC5.11 | v76,44.98 IC6.11 | v50.85,52.86 IC8.11 | IC9.11 v25.96,55.91 R77.1 | IC7.11 77.01,84.35 76.5,83.85 v71.68,83.85 | v56.03,41.89 58.27,39.65 Q2.C
STORE  (via drill 0.8, 0.8 pad 1.2)
  Top 1.016: v74.98,6.63 v100.38,6.63 125.5,6.63 v125.53,6.61 | v144.37,41.53 142.72,43.18 v127.56,43.18 102.69,43.18 v102.67,43.21 v78.54,43.21 70.15,43.21 62.53,50.83 v53.39,50.83 48.35,50.83 | v71.68,85.98 70.05,85.98 68.88,87.15 20.12,87.15 17.32,84.35 17.32,56.41 19.61,54.13 v28.5,54.13 28.7,54.13 32,50.83 48.35,50.83 | 48.35,50.83 v48.35,48.6
  Bottom 1.016: IC1.12 v74.98,6.63 | v100.38,6.63 IC2.12 | IC3.12 v125.53,6.61 139.73,6.61 144.37,11.25 v144.37,41.53 | IC4.12 127.61,49.5 127.61,43.23 v127.56,43.18 | v102.67,43.21 IC5.12 | v78.54,43.21 IC6.12 | v53.39,50.83 53.44,50.88 53.44,55.85 IC8.12 | IC9.12 v28.5,54.13 R78.1 | v71.68,85.98 76.1,85.98 77.01,86.89 IC7.12 | Q3.C 48.36,46.8 48.35,46.81 v48.35,48.6
VCC  (via drill 0.8)
  Top 1.016: v15.27,67.34 15.8,67.87 15.8,84.86 19.71,88.77 69.62,88.77 70.16,88.23 v71.68,88.23
  Bottom 1.016: 110.54,16.79 IC2.16 | 120.45,15.52 119.18,16.79 | IC7.16 82.35,97.05 | 82.35,97.05 82.35,83.34 80.82,81.81 IC7.10 | v71.68,88.23 70.36,88.23 69.75,88.84 69.75,95.64 76,101.88 81.08,101.88 82.35,100.61 82.35,97.05 | SV1.3 3.69,55.4 2.08,57.01 2.08,61.49 7.92,67.34 v15.27,67.34 15.8,66.8 15.8,50.34 | 15.8,50.34 14.25,48.79 7.16,48.79 5.13,46.76 5.13,26.95 7.23,24.84 9.23,24.84 10.72,23.36 U$2.VSYS | R78.2 R77.2 25.96,35.08 | SV2.5 33.58,35.08 | R76.2 63.8,24.66 64.06,24.92 | 20.37,35.08 20.37,45.77 15.8,50.34
  Bottom 1.27: 85.14,16.79 IC1.16 | IC2.10 95.3,16.79 | IC1.10 69.9,16.79 | IC3.10 120.45,15.52 | IC3.16 135.69,16.79 | IC4.16 137.72,53.37 | IC4.10 122.48,53.37 | IC5.10 97.59,53.37 | IC5.16 112.83,53.37 | IC6.10 73.46,53.11 73.2,53.37 | IC6.16 88.7,52.6 89.46,53.37 | 48.31,59.97 IC8.10 | IC8.16 63.55,59.97 | IC9.16 38.66,62.51
  Bottom 1.5: IC9.10 23.42,62 23.93,62.51
  Bottom 2.54: 63.14,59.97 69.75,53.37 73.2,53.37 89.46,53.37 97.59,53.37 112.83,53.37 122.48,53.37 137.72,53.37 140.77,53.37 143.81,50.32 143.81,46.36 141.68,44.22 141.68,18.72 139.75,16.79 135.69,16.79 119.18,16.79 110.54,16.79 95.3,16.79 85.14,16.79 69.9,16.79 64.84,16.79 64.06,17.57 64.06,24.92 64.06,25.93 60.5,29.49 42.72,29.49 37.13,35.08 33.58,35.08 25.96,35.08 20.37,35.08 16.76,35.08 13.59,31.9 J2.1 | 63.55,59.97 63.14,59.97 | 63.14,59.97 48.31,59.97 44.75,59.97 42.21,62.51 38.66,62.51 23.93,62.51
(copper drawn outside any net)
  shapes: Top circle x17

### Text on the board
Top: LED-Cube BS 3AHET | 5V | D | L | S | USB
Bottom: LED-Cube BS 3AHET